# EAGLE schematic PISANG2 (EAGLE 7.1.0)
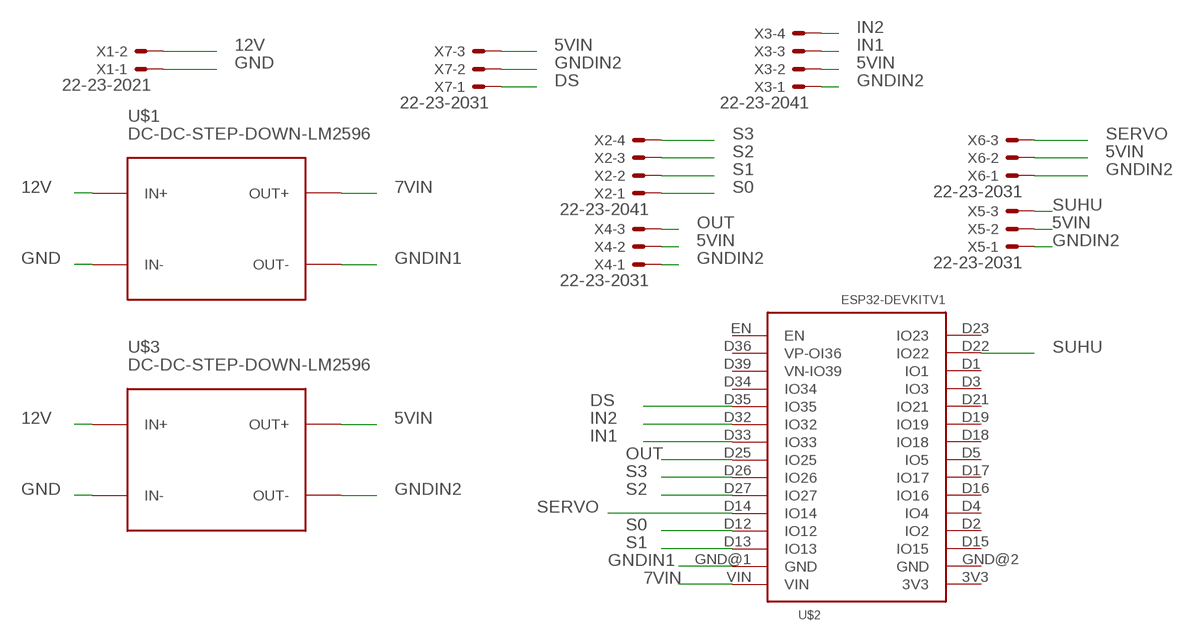
[diagram p0: schematic, sheet 1]

## Parts
U$1  DC-DC-STEP-DOWN-LM2596  [DC-DC-STEP-DOWN-LM2596]
U$2  ESP32DEVKITV1  [ESP32-DEVKITV1]
U$3  DC-DC-STEP-DOWN-LM2596  [DC-DC-STEP-DOWN-LM2596]
X1  22-23-2021  [22-23-2021]
X2  22-23-2041  [22-23-2041]
X3  22-23-2041  [22-23-2041]
X4  22-23-2031  [22-23-2031]
X5  22-23-2031  [22-23-2031]
X6  22-23-2031  [22-23-2031]
X7  22-23-2031  [22-23-2031]

## Nets
5VIN: U$3.OUT+ X3.2 X4.2 X5.2 X6.2 X7.3
7VIN: U$1.OUT+ U$2.VIN
12V: U$1.IN+ U$3.IN+ X1.2
DS: U$2.D35(IO35) X7.1
GND: U$1.IN- U$3.IN- X1.1
GNDIN1: U$1.OUT- U$2.GND@1(GND)
GNDIN2: U$3.OUT- X3.1 X4.1 X5.1 X6.1 X7.2
IN1: U$2.D33(IO33) X3.3
IN2: U$2.D32(IO32) X3.4
OUT: U$2.D25(IO25) X4.3
S0: U$2.D12(IO12) X2.1
S1: U$2.D13(IO13) X2.2
S2: U$2.D27(IO27) X2.3
S3: U$2.D26(IO26) X2.4
SERVO: U$2.D14(IO14) X6.3
SUHU: U$2.D22(IO22) X5.3
Unconnected: U$2.3V3 U$2.D1(IO1) U$2.D2(IO2) U$2.D3(IO3) U$2.D4(IO4) U$2.D5(IO5) U$2.D15(IO15) U$2.D16(IO16) U$2.D17(IO17) U$2.D18(IO18) U$2.D19(IO19) U$2.D21(IO21) U$2.D23(IO23) U$2.D34(IO34) U$2.D36(VP-OI36) U$2.D39(VN-IO39) U$2.EN U$2.GND@2(GND)

## Library data of the parts
U$1 U$3 = diy-modules (2):DC-DC-STEP-DOWN-LM2596: DC/DC Step-Down Regulator based on LM2596-ADJ chip LM2596 datasheet available here: http://www.ti.com/lit/ds/symlink/lm2596.pdf Click here to find device on ebay.com <http://www.ebay.com/sch/lm2596+power+regulator>
U$2 = ESP32-DEVKITV1:ESP32DEVKITV1
X1 = con-molex:22-23-2021: .100" (2.54mm) Center Header - 2 Pin; MF: MOLEX; MPN: 22-23-2021; OC_FARNELL: 1462926; OC_NEWARK: 25C3832
X2 X3 = con-molex:22-23-2041: .100" (2.54mm) Center Header - 4 Pin; MF: MOLEX; MPN: 22-23-2041; OC_FARNELL: 1462920; OC_NEWARK: 38C0355
X4-X7 = con-molex:22-23-2031: .100" (2.54mm) Center Header - 3 Pin; MF: MOLEX; MPN: 22-23-2031; OC_FARNELL: 1462950; OC_NEWARK: 30C0862